# EAGLE design BPW5036-VGA_V1.3 (EAGLE 5.11)
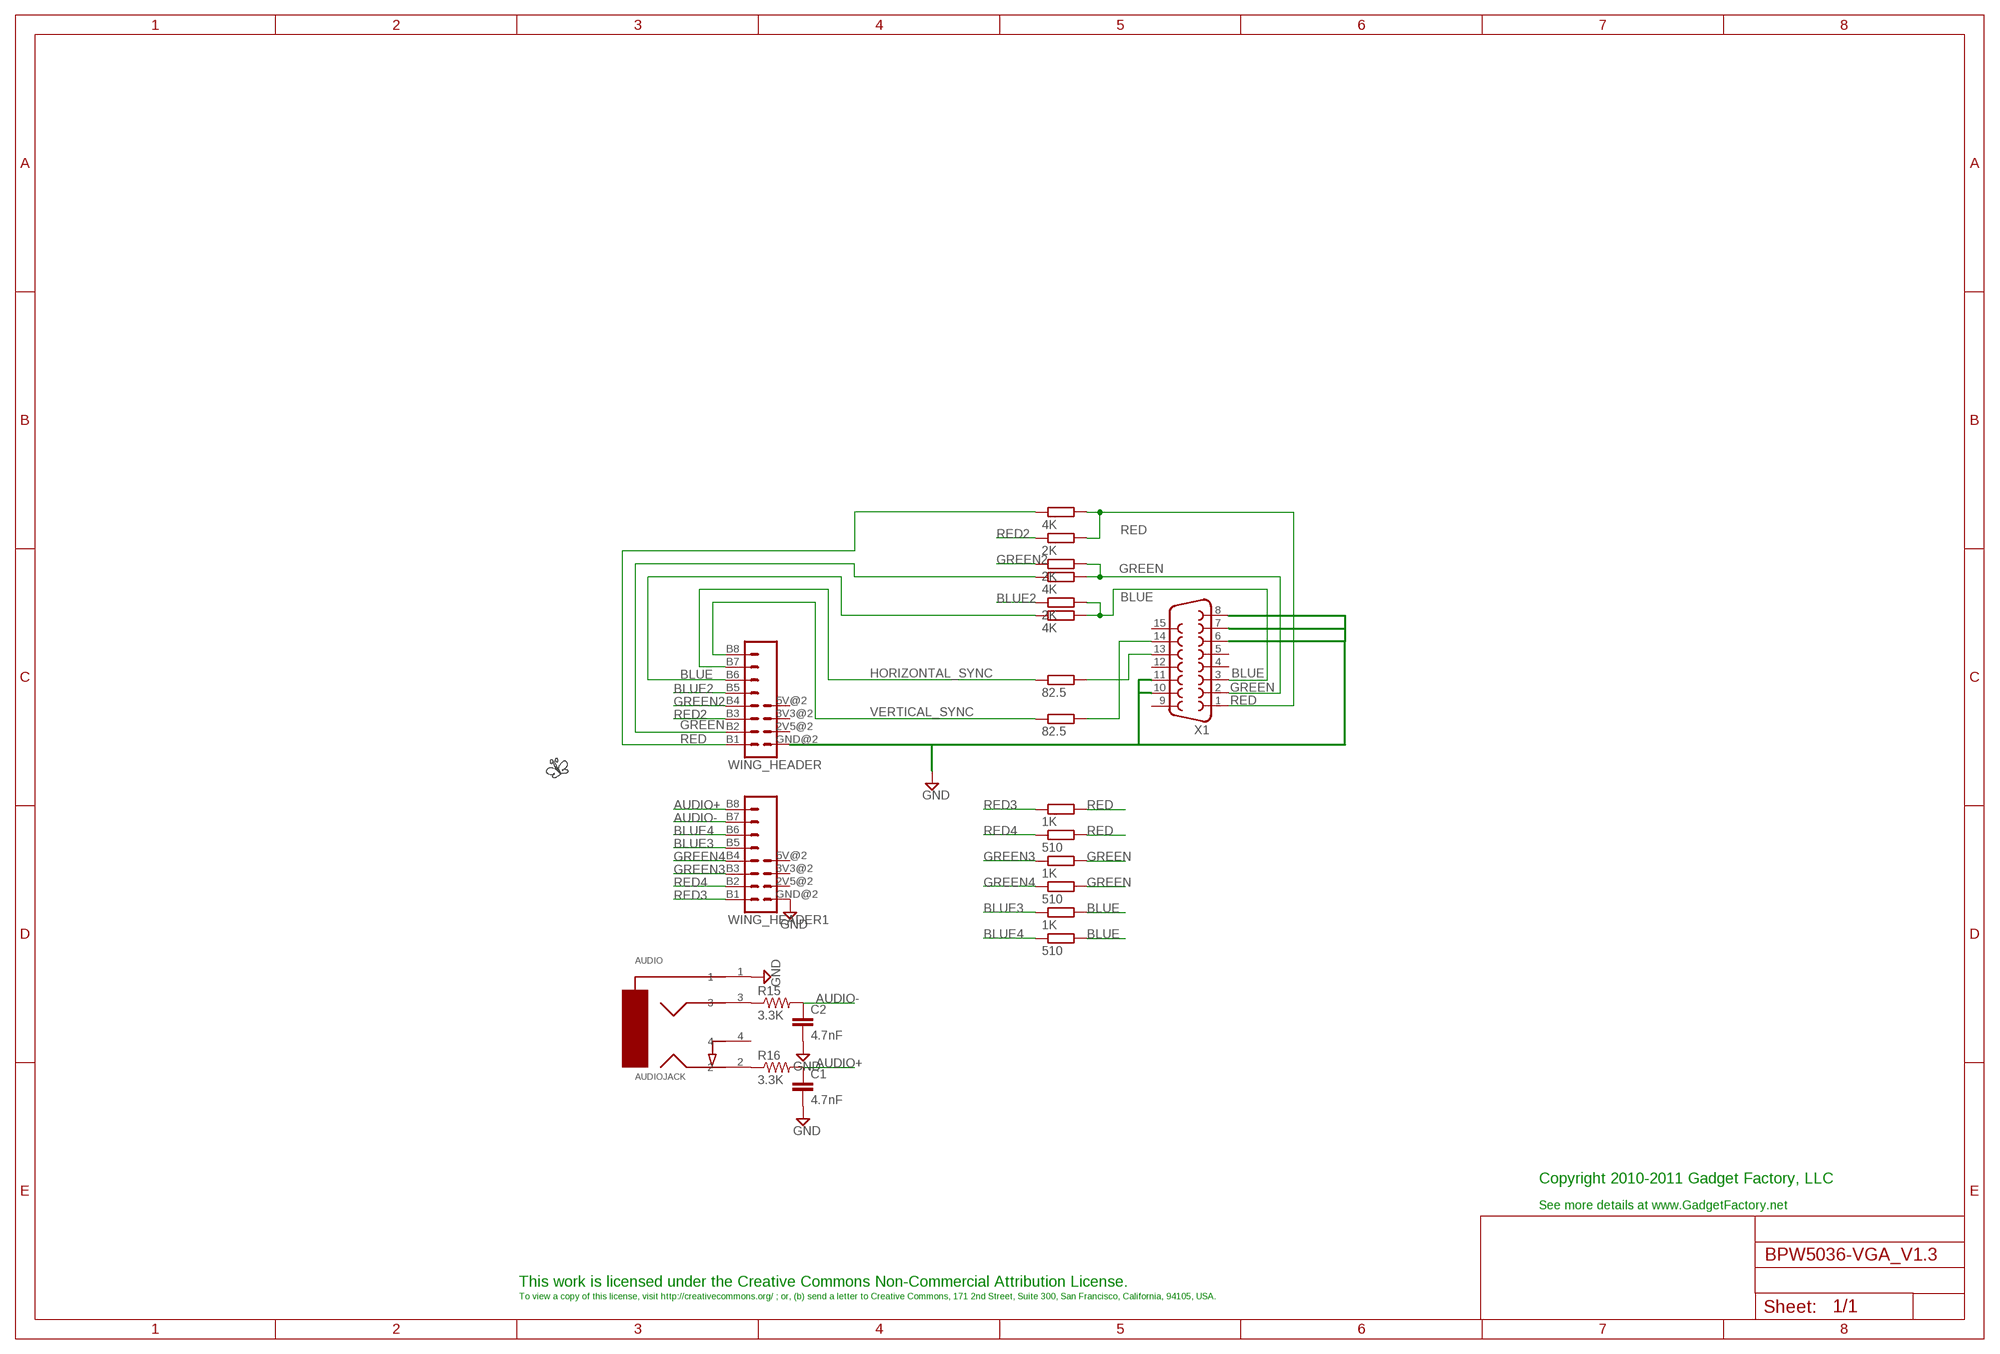
[diagram p0: schematic, sheet 1]

## Parts
AUDIO  AUDIOJACK  [AUDJCK]
C1  4.7nF  C-EU050-025X075  [C050-025X075]
C2  4.7nF  C-EU050-025X075  [C050-025X075]
LOGO2  BUTTERFLY_LOGO  [BUTTERFLY_LOGO]
R1  4K  R-EU_0207/10  [0207/10]
R2  4K  R-EU_0207/10  [0207/10]
R3  4K  R-EU_0207/10  [0207/10]
R4  82.5  R-EU_0207/10  [0207/10]
R5  82.5  R-EU_0207/10  [0207/10]
R6  2K  R-EU_0207/10  [0207/10]
R7  2K  R-EU_0207/10  [0207/10]
R8  2K  R-EU_0207/10  [0207/10]
R9  1K  R-EU_0207/10  [0207/10]
R10  510  R-EU_0207/10  [0207/10]
R11  1K  R-EU_0207/10  [0207/10]
R12  510  R-EU_0207/10  [0207/10]
R13  1K  R-EU_0207/10  [0207/10]
R14  510  R-EU_0207/10  [0207/10]
R15  3.3K  R-US_0204/7  [0204/7]
R16  3.3K  R-US_0204/7  [0204/7]
WING_HEADER  WING_8BIT  [WINGSIDE_8BIT]
WING_HEADER1  WING_8BIT  [WINGSIDE_8BIT]
X1  F15HDH  [HDF15H]

## Nets
AUDIO+: C1.1 R16.2 WING_HEADER1.B8
AUDIO-: C2.1 R15.2 WING_HEADER1.B7
BLUE: R3.2 R8.2 R13.2 R14.2 X1.3
BLUE2: R8.1 WING_HEADER.B5
BLUE3: R13.1 WING_HEADER1.B5
BLUE4: R14.1 WING_HEADER1.B6
GND: AUDIO.1 C1.2 C2.2 WING_HEADER1.GND@2(GND) WING_HEADER.GND@2(GND) X1.6 X1.7 X1.8 X1.10 X1.11
GREEN: R2.2 R7.2 R11.2 R12.2 X1.2
GREEN2: R7.1 WING_HEADER.B4
GREEN3: R11.1 WING_HEADER1.B3
GREEN4: R12.1 WING_HEADER1.B4
HORIZONTAL_SYNC: R4.1 WING_HEADER.B7
N$1: AUDIO.3 R15.1
N$2: AUDIO.2 R16.1
N$4: R4.2 X1.13
N$5: R5.2 X1.14
N$6: R1.1 WING_HEADER.B1
N$7: R2.1 WING_HEADER.B2
N$8: R3.1 WING_HEADER.B6
RED: R1.2 R6.2 R9.2 R10.2 X1.1
RED2: R6.1 WING_HEADER.B3
RED3: R9.1 WING_HEADER1.B1
RED4: R10.1 WING_HEADER1.B2
VERTICAL_SYNC: R5.1 WING_HEADER.B8
Unconnected: AUDIO.4 WING_HEADER1.2V5@2(2V5) WING_HEADER1.3V3@2(3V3) WING_HEADER1.5V@2(5V) WING_HEADER.2V5@2(2V5) WING_HEADER.3V3@2(3V3) WING_HEADER.5V@2(5V) X1.4 X1.5 X1.9 X1.12 X1.15

## Notes on the sheet
- BLUE
- GREEN
- RED
- Copyright 2010-2011 Gadget Factory, LLC
- See more details at www.GadgetFactory.net
- This work is licensed under the Creative Commons Non-Commercial Attribution License.
- To view a copy of this license, visit http://creativecommons.org/ ; or, (b) send a letter to Creative Commons, 171 2nd Street, Suite 300, San Francisco, California, 94105, USA.

## Library data of the parts
AUDIO = GadgetFactory:AUDIOJACK
C1 C2 = resistor:C-EU: CAPACITOR, European symbol
LOGO2 = GadgetFactory_Pub:BUTTERFLY_LOGO
R1-R14 = resistor:R-EU_: RESISTOR, European symbol
R15 R16 = resistor:R-US_: RESISTOR, American symbol
WING_HEADER WING_HEADER1 = GadgetFactory_Pub:WING_8BIT
X1 = con-subd:F15: SUB-D

## Board
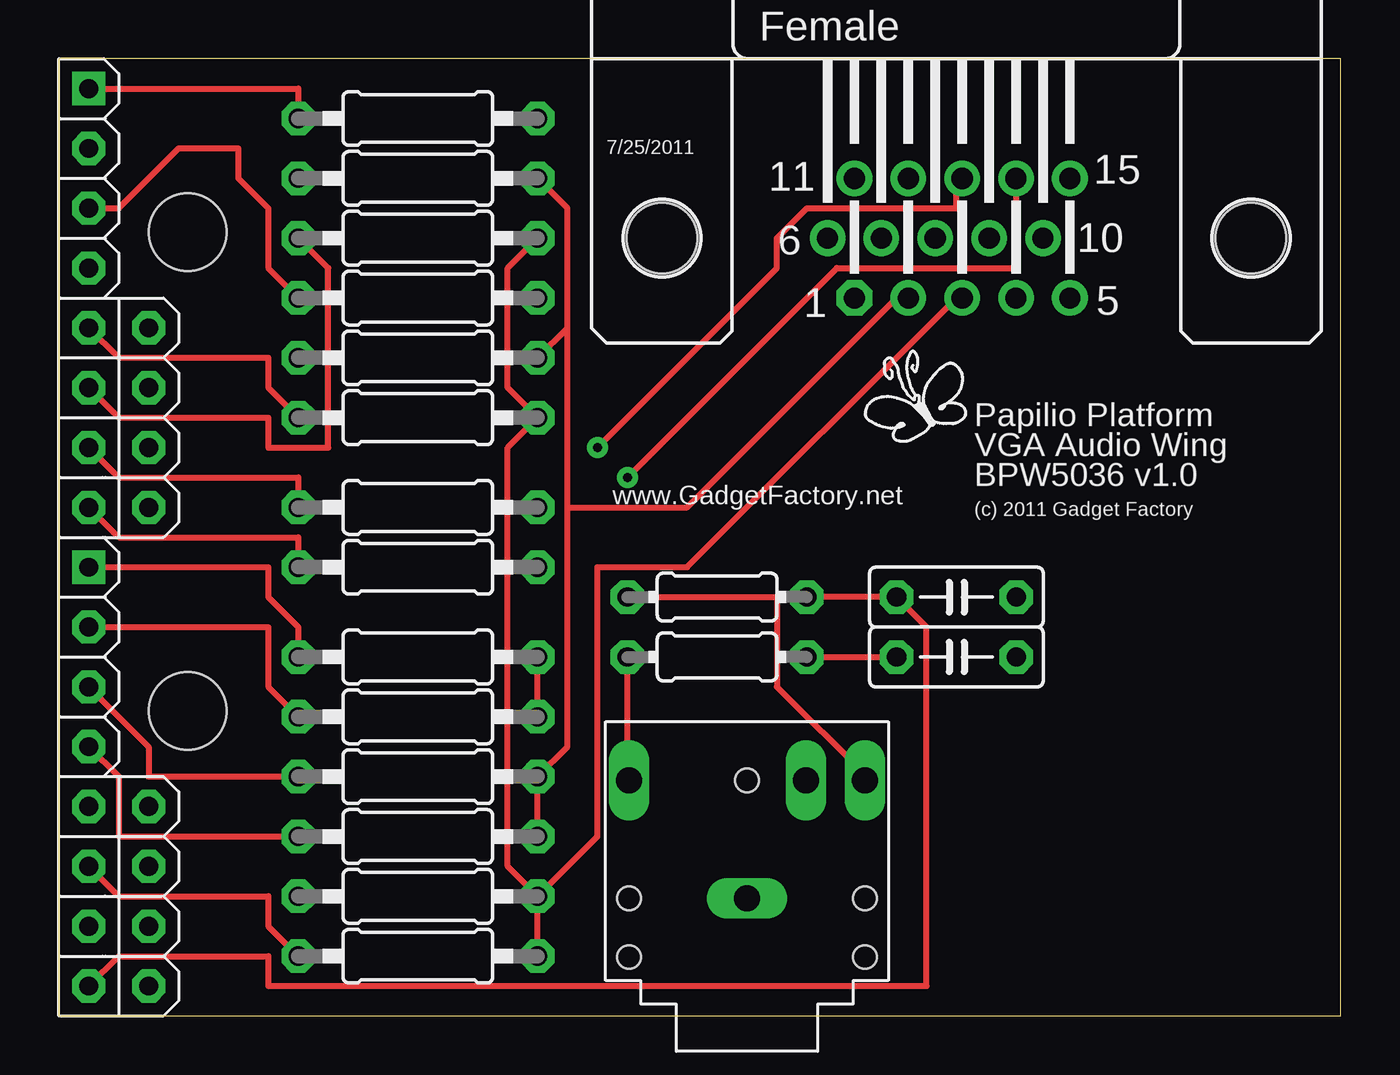
[diagram p1: board, top side]
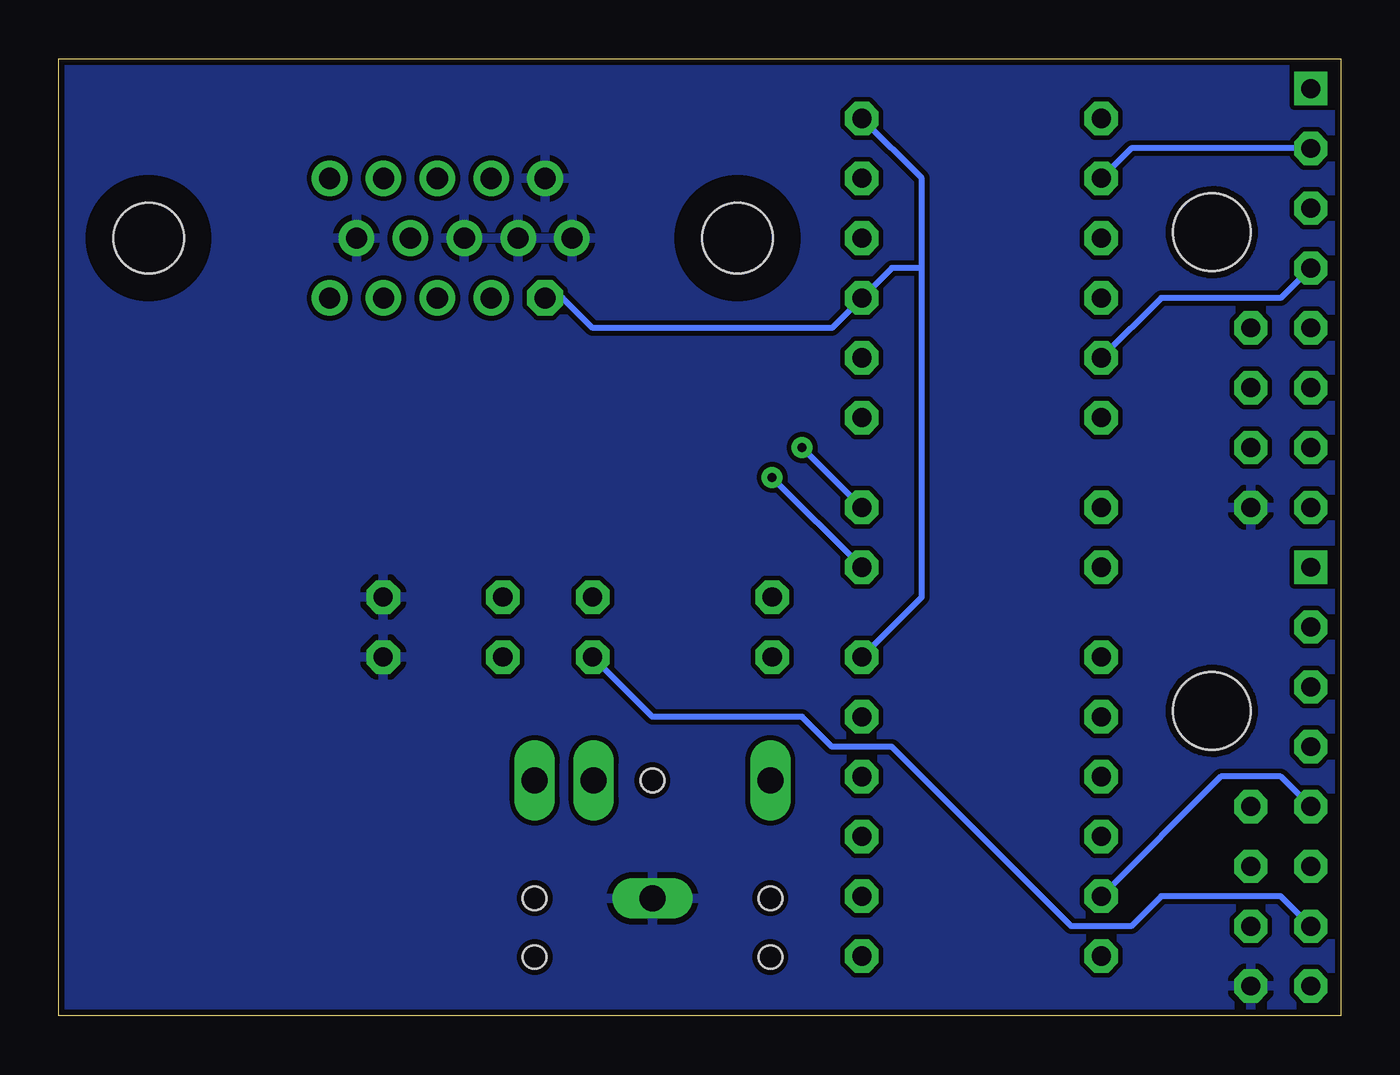
[diagram p2: board, bottom side, seen from below]

Size 54.41 x 40.63 mm. Coordinates in mm from the lower left corner, seen from the top.
Outline: 0,0 54.41,0 54.41,40.63 0,40.63 0,0
Copper layers (1*16): Top 0.035mm / dielectric 1.5mm / Bottom 0.035mm
Design rules "SparkFun_Derived_GoldePheonix_10mil": minimum track width 10mil, minimum drill 15mil, track to track 8mil, track to pad 8mil, pad to pad 8mil, via to via 8mil, smd to smd 8mil, copper to edge 10mil, drill to drill 8mil, minimum pad ring 12mil, minimum via ring 10mil, stop-mask expansion 4mil, vias tented up to drill 18mil, thermal gap 10mil

### Footprints (pad centres in the part's own frame; a part is rotated, then mirrored left to right if it is on the bottom)
AUDJCK = drill 1.1 long: 1 -5,0; 2 -10,5; 3 -10,-5; 4 -10,2.5 | hole 1: -5,5; -5,-5; -2.5,5; -2.5,-5; -10,0
C050-025X075 = drill 0.813 octagon: 1 -2.54,0; 2 2.54,0
0207/10 = drill 0.813 octagon: 1 -5.08,0; 2 5.08,0
0204/7 = drill 0.813 octagon: 1 -3.81,0; 2 3.81,0
WINGSIDE_8BIT = drill 0.8 octagon: 2V5@2 16.51,3.81; 3V3@2 13.97,3.81; 5V@2 11.43,3.81; B2 3.81,1.27; B3 6.35,1.27; B4 8.89,1.27; B5 11.43,1.27; B6 13.97,1.27; B7 16.51,1.27; B8 19.05,1.27; GND@2 19.05,3.81 | drill 0.8 square: B1 1.27,1.27 | hole 3.302: 7.366,5.461
HDF15H = drill 0.9 octagon: 1 4.329,2.54 | drill 0.9 round: 2 2.043,2.54; 3 -0.243,2.54; 4 -2.529,2.54; 5 -4.815,2.54; 6 5.472,0; 7 3.186,0; 8 0.9,0; 9 -1.386,0; 10 -3.672,0; 11 4.329,-2.54; 12 2.043,-2.54; 13 -0.243,-2.54; 14 -2.529,-2.54; 15 -4.815,-2.54 | hole 3: -12.5,0; 12.5,0

### Placement (x,y rotation side)
AUDIO  29.21,0 270 top
C1  38.1,17.78 0 top
C2  38.1,15.24 0 top
LOGO2  36.45,25.78 0 top
R1  15.24,38.1 0 top
R2  15.24,35.56 0 top
R3  15.24,33.02 0 top
R4  15.24,21.59 0 top
R5  15.24,19.05 0 top
R6  15.24,30.48 0 top
R7  15.24,27.94 0 top
R8  15.24,25.4 0 top
R9  15.24,15.24 0 top
R10  15.24,12.7 0 top
R11  15.24,10.16 0 top
R12  15.24,7.62 0 top
R13  15.24,5.08 0 top
R14  15.24,2.54 0 top
R15  27.94,15.24 0 top
R16  27.94,17.78 0 top
WING_HEADER  0,40.64 270 top
WING_HEADER1  0,20.32 270 top
X1  38.1,33.02 180 top

### Tracks (layer width: path | path; a pad name or v marks a point on that pad's centre or on a via)
AUDIO+
  Top 0.254: WING_HEADER1.B8 2.54,2.54 8.89,2.54 8.89,1.27 36.83,1.27 36.83,16.51 C1.1 R16.2
AUDIO-
  Top 0.254: R15.2 C2.1
  Bottom 0.254: WING_HEADER1.B7 2.54,5.08 7.62,5.08 8.89,3.81 11.43,3.81 19.05,11.43 21.59,11.43 22.86,12.7 29.21,12.7 R15.2
BLUE
  Top 0.254: R3.2 19.05,31.75 19.05,26.67 R8.2 19.05,24.13 19.05,6.35 R13.2 | R14.2 R13.2 | R13.2 22.86,7.62 22.86,19.05 26.67,19.05 38.1,30.48 X1.3
BLUE2
  Top 0.254: WING_HEADER.B5 2.54,27.94 8.89,27.94 8.89,26.67 R8.1
BLUE3
  Bottom 0.254: WING_HEADER1.B5 2.54,10.16 5.08,10.16 R13.1
BLUE4
  Top 0.254: WING_HEADER1.B6 2.54,5.08 8.89,5.08 8.89,3.81 R14.1
GND
  pour Bottom: 0,40.64 54.61,40.64 54.61,0 0,0
GREEN
  Top 0.254: R12.2 R11.2 21.59,11.43 21.59,21.59 | 21.59,29.21 R7.2 | 21.59,29.21 21.59,34.29 R2.2 | 21.59,21.59 26.67,21.59 35.56,30.48 X1.2 | 21.59,21.59 21.59,29.21
GREEN2
  Bottom 0.254: WING_HEADER.B4 2.54,30.48 7.62,30.48 R7.1
GREEN3
  Top 0.254: WING_HEADER1.B3 3.81,11.43 3.81,10.16 R11.1
GREEN4
  Top 0.254: WING_HEADER1.B4 2.54,10.16 2.54,7.62 R12.1
HORIZONTAL_SYNC
  Top 0.254: WING_HEADER.B7 2.54,22.86 10.16,22.86 R4.1
N$1
  Top 0.254: R15.1 24.13,10.16 AUDIO.3
N$2
  Top 0.254: R16.1 30.48,17.78 30.48,13.97 34.29,10.16 AUDIO.2
N$4  (via drill 0.38)
  Top 0.254: v22.86,24.13 30.48,31.75 30.48,33.02 31.75,34.29 38.1,34.29 38.1,35.56 X1.13
  Bottom 0.254: R4.2 v22.86,24.13
N$5  (via drill 0.38)
  Top 0.254: v24.13,22.86 33.02,31.75 40.64,31.75 X1.14
  Bottom 0.254: R5.2 v24.13,22.86
N$6
  Top 0.254: WING_HEADER.B1 10.16,39.37 R1.1
N$7
  Bottom 0.254: WING_HEADER.B2 8.89,36.83 R2.1
N$8
  Top 0.254: WING_HEADER.B6 2.54,25.4 8.89,25.4 8.89,24.13 11.43,24.13 11.43,31.75 R3.1
RED
  Top 0.254: R10.2 R9.2
  Bottom 0.254: X1.1 33.02,30.48 31.75,29.21 21.59,29.21 R6.2 19.05,31.75 17.78,31.75 | R1.2 17.78,35.56 17.78,31.75 | R9.2 17.78,17.78 17.78,31.75
RED2
  Top 0.254: WING_HEADER.B3 2.54,34.29 5.08,36.83 7.62,36.83 7.62,35.56 8.89,34.29 8.89,31.75 R6.1
RED3
  Top 0.254: WING_HEADER1.B1 8.89,19.05 8.89,17.78 10.16,16.51 R9.1
RED4
  Top 0.254: WING_HEADER1.B2 8.89,16.51 8.89,13.97 R10.1
VERTICAL_SYNC
  Top 0.254: WING_HEADER.B8 2.54,20.32 10.16,20.32 R5.1

### Text on the board
tPlace: 7/25/2011 | Papilio Platform | VGA Audio Wing | www.GadgetFactory.net | BPW5036 v1.0 | (c) 2011 Gadget Factory